# EasyEDA Pro project ProDocument_PCB1_2024-07-26.epro

# Board PCB1
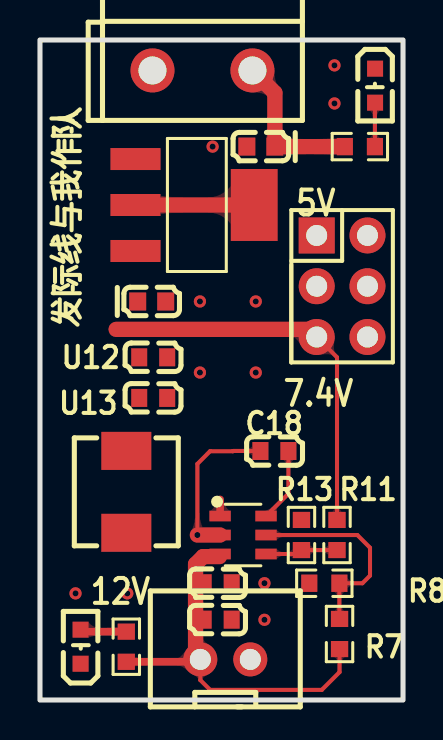
[diagram p0: board, top side]
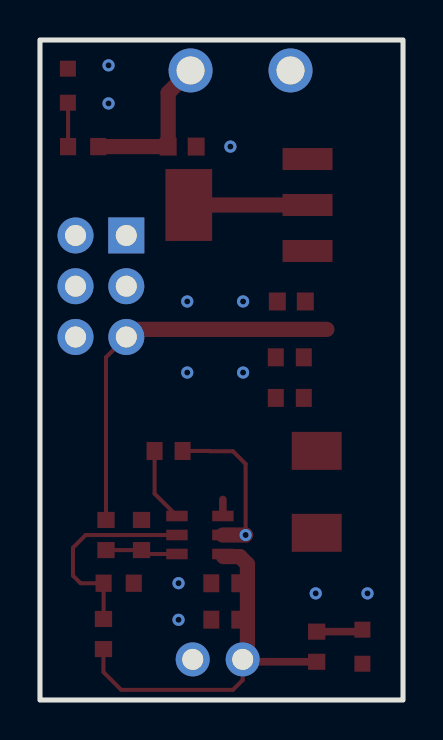
[diagram p1: board, bottom side, seen from below]

Outline 18.16 x 33.02 mm; copper layers: Top Layer, Bottom Layer. Coordinates in mm from the lower left corner of the outline.
Outline path: rectangle 0,33.02 18.16,0
Stack: Top Layer 0.035mm / Dielectric1 1.51mm FR4 er 4.5 / Bottom Layer 0.035mm

## Design rules (mm)
template: 自定义配置
spacing copperThickness1oz (default): track to track 0.203, other pairs 0.203 to 0.203
spacing copperThickness2oz: track to track 0.203, other pairs 0.152 to 0.3
track width copperThickness1oz (default): min 0.152, default 0.203, max 0.762
track width copperThickness2oz: min 0.203, default 0.254, max 2.54
track width VCC: min 0.203, default 0.762, max 0.762
differential pair differentialPair (default): width min 0.127, default 0.254, max 2.54; gap min 0.152, default 0.152
via viaSize (default): diameter min 0.5, default 0.61, max 10; hole min 0.3, default 0.305, max 6.299
net 5V uses VCC, copperRegion1
net PGND uses VCC, copperRegion1
net $1N3839 uses copperRegion1
net VCC-12V uses copperRegion1
net 7.4V uses copperRegion1

## Placement (name value [footprint] x y rotation side)
C18  100nF  [C0603]  11.73 12.46 180 top
C27  10uF  [CAP-SMD_L1.6-W0.9-FD]  11.05 27.69 180 top
C28  10uF  [CAP-SMD_L1.6-W0.9-FD]  5.59 19.94 0 top
CN3  HX25037-2A  [CONN-TH_2P-P2.50-XH2.54-2P]  9.27 2.03 180 top
J1  2.54-2*3P针  [HDR-TH_6P-P2.54-V-M-R2-C3-S2.54-1]  15.11 20.7 270 top
L3  10uH  [IND-SMD_L5.4-W5.2_FXL0530]  4.32 10.41 90 top
LED1  NCD0603R3  [LED0603-R-RD_RED]  16.76 30.73 270 top
LED2  NCD0603R3  [LED0603-R-RD_RED]  2.03 2.67 90 top
R7  511kΩ  [R0603]  14.99 3.3 270 top
R8  100kΩ  [R0603]  14.22 5.84 180 top
R11  100kΩ  [R0603]  14.86 8.25 90 top
R13  11kΩ  [R0603]  13.08 8.25 270 top
R106  30K  [R0603]  16 27.69 180 top
R107  30K  [R0603]  4.32 2.67 270 top
U4  AMS1117-3.3  [SOT-223-3_L6.4-W3.5-P2.30-LS7.0-BR]  7.75 24.77 180 top
U11  TPS54302DDCR  [SOT-23-6_L2.9-W1.6-P0.95-LS2.8-BL]  10.16 8.25 270 top
U12  10uF  [C0603]  5.66 17.14 0 top
U13  100nf  [C0603]  5.66 15.11 0 top
U42  -  [C0603]  8.89 5.84 0 top
U42#2  -  [C0603]  8.89 4.02 0 top
U48  KF301R-5.0-2P  [CONN-TH_P5.00_KF301R-5.0-2P]  8.13 31.5 180 top

## Footprints (pads in the part's own frame, mm; a bottom-side part is the same pattern mirrored in y, then rotated)
C0603
  rect 0.8x0.9 smd: 1(-0.7,0) 2(0.7,0)
CAP-SMD_L1.6-W0.9-FD
  rect 0.85x0.9 smd: 1(-0.7,0) 2(0.7,0)
CONN-TH_2P-P2.50-XH2.54-2P
  round 1.7 hole 1.05: 1(1.25,0) 2(-1.25,0)
CONN-TH_P5.00_KF301R-5.0-2P
  round 2.2 hole 1.4: 1(-2.5,0) 2(2.5,0)
HDR-TH_6P-P2.54-V-M-R2-C3-S2.54-1
  rect 1.8x1.8 hole 1.05: 1(-2.54,-1.27)
  round 1.8 hole 1.05: 2(-2.54,1.27) 3(0,-1.27) 4(0,1.27) 5(2.54,-1.27) 6(2.54,1.27)
IND-SMD_L5.4-W5.2_FXL0530
  rect 1.9x2.5 smd: 1(-2.05,0) 2(2.05,0)
LED0603-R-RD_RED
  rect 0.8x0.8 smd: 1(0.851,0) 2(-0.851,0)
R0603
  rect 0.806x0.864 smd: 1(-0.753,0) 2(0.753,0)
SOT-23-6_L2.9-W1.6-P0.95-LS2.8-BL
  rect 0.532x1.072 smd: 1(-0.95,-1.149) 2(0,-1.149) 3(0.95,-1.149) 4(0.95,1.149) 5(0,1.149) 6(-0.95,1.149)
SOT-223-3_L6.4-W3.5-P2.30-LS7.0-BR
  rect 2.499x1.1 smd: 1(2.97,-2.299) 2(2.97,0) 3(2.97,2.301)
  rect 2.34x3.599 smd: 4(-2.97,0)

## Nets
5V: C27.1 J1.1 J1.3 R106.2 U4.2 U4.4 U48.1
7.4V: C28.1 J1.5 L3.2 R11.2 U4.3 U12.1 U13.1
PGND: C27.2 C28.2 CN3.2 J1.2 J1.4 J1.6 LED1.2 LED2.2 R8.2 R13.1 U4.1 U11.1 U12.2 U13.2 U42.2 U42#2.2 U48.2
VCC-12V: CN3.1 R7.2 R107.2 U11.3 U42.1 U42#2.1
$1N3633: R7.1 R8.1 U11.5
$1N3799: C18.1 U11.6
$1N3839: C18.2 L3.1 U11.2
$1N3988: R11.1 R13.2 U11.4
$1N14940: LED1.1 R106.1
$1N15092: LED2.1 R107.1

## Via types
v1: diameter 0.61, hole 0.305, Top Layer to Bottom Layer, 12 vias

## Routing (per net, layer and track width the routed paths; a pad name or vN(x,y) marks a point on that pad's centre or on a via; arc(x,y) is an arc through that point)
5V: length 13.7
  Top Layer w0.762: U4.2 U4.4 ; R106.2 C27.1 11.75,30.38 U48.1
7.4V: length 19.8
  Top Layer w0.203: J1.5 14.86,17.14 R11.2
  Top Layer w0.762: J1.5 13.46,18.54 3.81,18.54
PGND: length 0.8
  Top Layer w0.381: U11.1 9.01,10.03
  vias: v1(1.78,5.33) v1(4.37,5.33) v1(8,19.94) v1(8,16.38) v1(8.64,27.69) v1(10.79,19.94) v1(10.79,16.38) v1(11.23,5.84) v1(11.23,4.01) v1(14.73,31.75) v1(14.73,29.84)
VCC-12V: length 19.7
  Top Layer w0.203: CN3.1 8.02,1 8.51,0.51 14.1,0.51 14.99,1.4 R7.2
  Top Layer w0.381: CN3.1 7.9,1.91 R107.2
  Top Layer w0.762: 8.98,7.18 8.16,7.18 7.78,6.79 7.78,2.27 CN3.1
$1N3633: length 10.3
  Top Layer w0.203: R7.1 14.98,4.06 R8.1 16.13,5.84 16.51,6.22 16.51,7.62 15.88,8.25 U11.5
$1N3799: length 3.7
  Top Layer w0.203: U11.6 12.43,10.32 C18.1
$1N3839: length 8.1
  Top Layer w0.203: C18.2 9.66,12.46 9.65,12.45 8.51,12.45 7.87,11.81 v1(7.87,8.25)
  Top Layer w0.762: U11.2 v1(7.87,8.25)
$1N3988: length 3.6
  Top Layer w0.203: R11.1 R13.2 12.88,7.3 U11.4
$1N14940: length 2.2
  Top Layer w0.203: R106.1 16.76,29.76 16.64,29.88
$1N15092: length 2.3
  Top Layer w0.381: LED2.1 2.13,3.42 R107.1

## Copper pours and planes (outline as drawn; the poured copper is in the pictures)
5V on Top Layer: 12.83,19.64 15.11,19.64 15.11,28.45 12.83,28.45
5V on Top Layer: 11.21,22.97 12.26,22.97 12.26,28.78 11.21,28.78
7.4V on Top Layer: 2.41,23.24 5.66,23.24 5.66,11.05 2.41,11.05
PGND on Top Layer: -0.51,-0.38 18.67,-0.38 18.67,33.53 -0.51,33.53
PGND on Bottom Layer: 0,0.03 18.54,0.03 18.54,33.15 0,33.15
VCC-12V on Top Layer: 6.61,1.04 8.89,1.04 8.89,7.33 6.61,7.33
$1N3839 on Top Layer: 2.67,9.29 2.67,7.24 3.18,6.73 5.38,6.73 6.36,7.71 9.03,7.71 9.36,8.04 9.36,8.47 9.06,8.76 6.48,8.76 5.46,9.78 3.16,9.78

Small or netless copper shapes (teardrops, artwork), in the pictures only: 34 on Top Layer

## Text on the board
Top Silkscreen Layer: 7.4V | 5V | 12V | 发际线与我作队
